# EAGLE design MKX-controller (EAGLE 6.3)
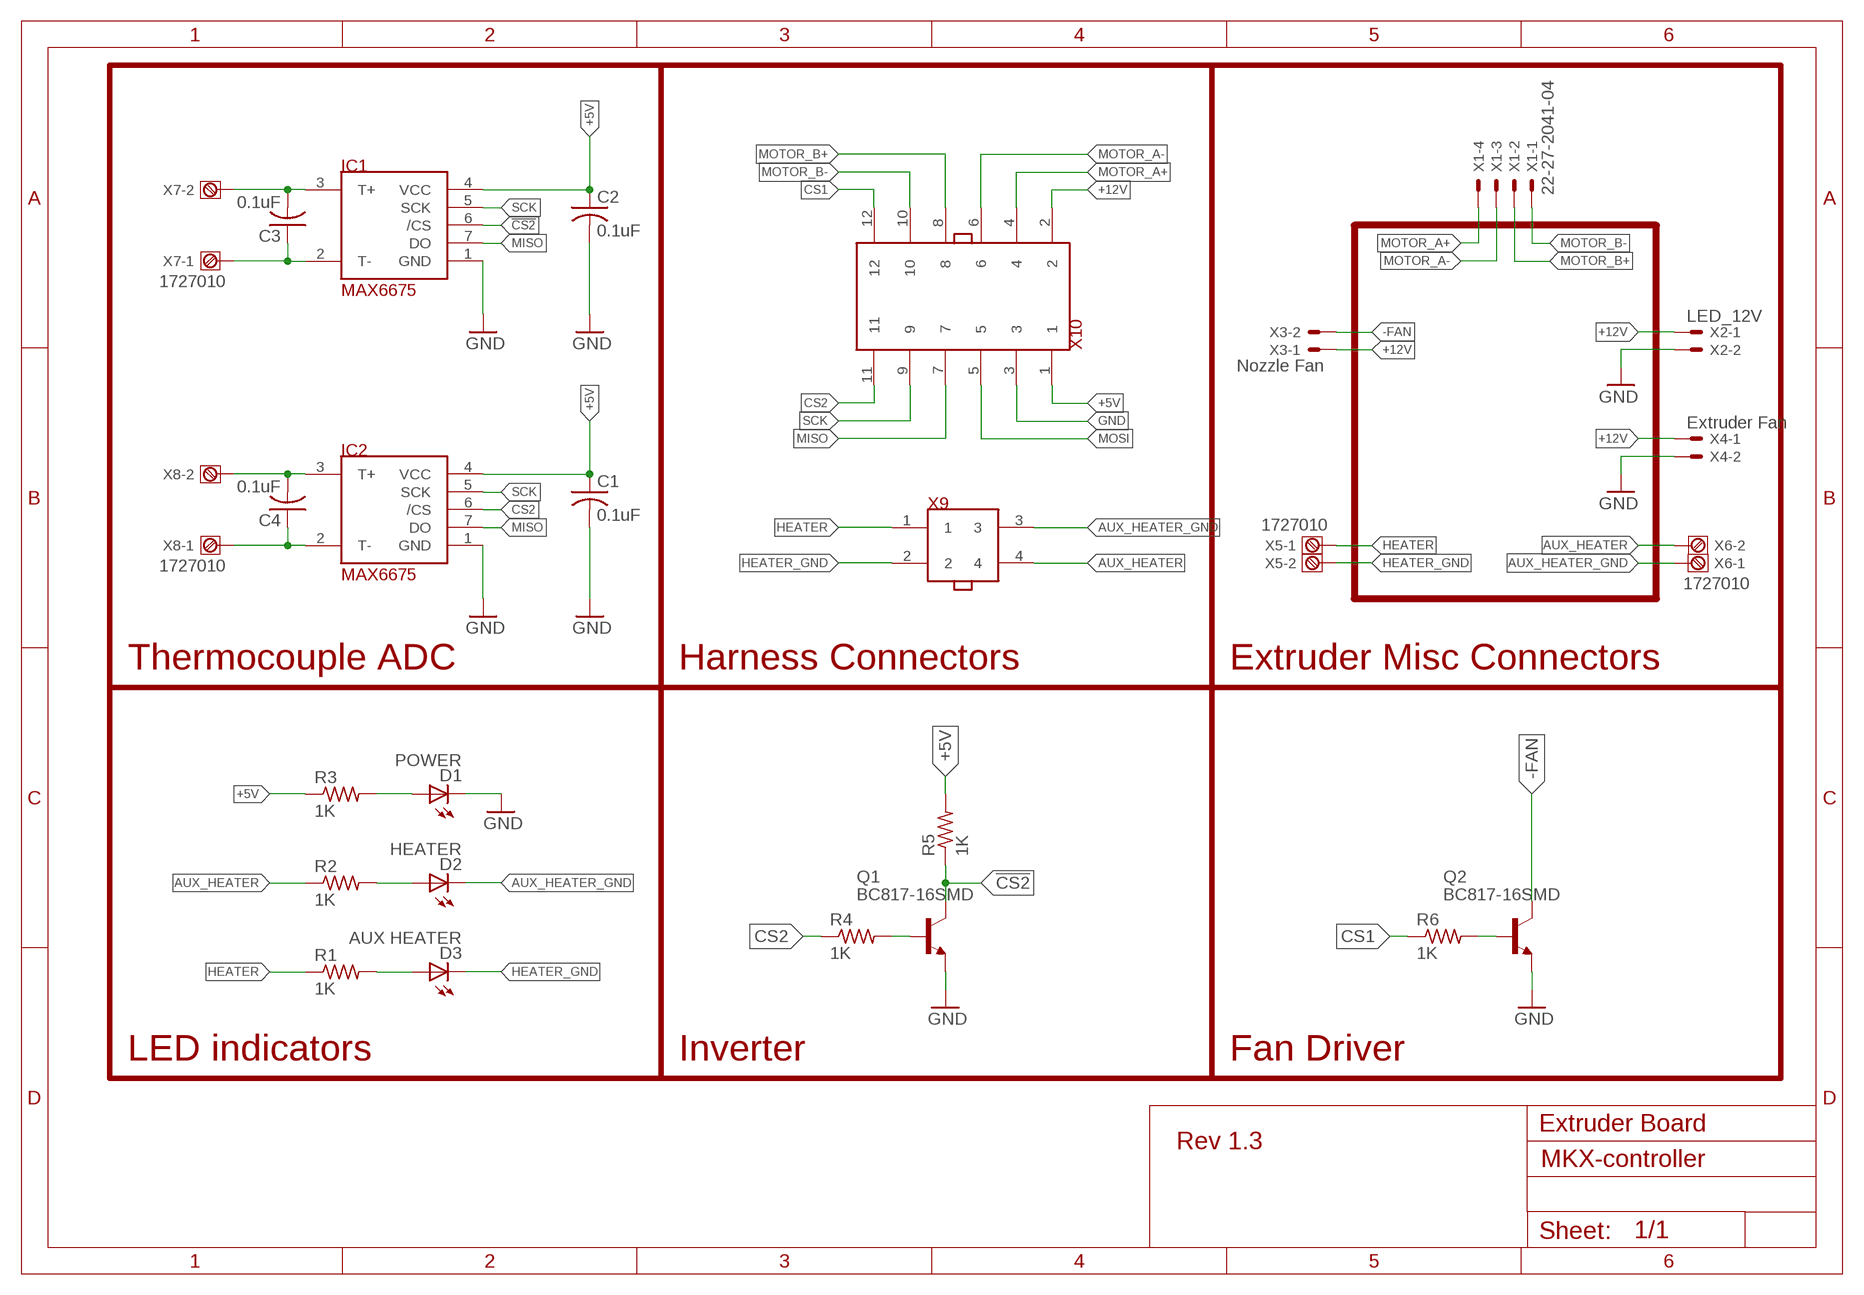
[diagram p0: schematic, sheet 1]

## Parts
C1  0.1uF  C-USC0603K  [C0603K]
C2  0.1uF  C-USC0603K  [C0603K]
C3  0.1uF  C-USC0603K  [C0603K]
C4  0.1uF  C-USC0603K  [C0603K]
D1  POWER  LEDCHIPLED_0805  [CHIPLED_0805]
D2  HEATER  LEDCHIPLED_0805  [CHIPLED_0805]
D3  AUX HEATER  LEDCHIPLED_0805  [CHIPLED_0805]
IC1  MAX6675  [SO-8]
IC2  MAX6675  [SO-8]
Q1  BC817-16SMD  [SOT23-BEC]
Q2  BC817-16SMD  [SOT23-BEC]
R1  1K  R-US_R0603  [R0603]
R2  1K  R-US_R0603  [R0603]
R3  1K  R-US_R0603  [R0603]
R4  1K  R-US_R0603  [R0603]
R5  1K  R-US_R0603  [R0603]
R6  1K  R-US_R0603  [R0603]
X1  22-27-2041-04  [6410-04]
X2  LED_12V  22-27-2021-02  [6410-02]
X3  Nozzle Fan  22-27-2021-02  [6410-02]
X4  Extruder Fan  22-27-2021-02  [6410-02]
X5  1727010  [1727010]
X6  1727010  [1727010]
X7  1727010  [1727010]
X8  1727010  [1727010]
X9  5557-04  [5557-04]
X10  5557-12  [5557-12]

## Nets
!CS2: IC1.6(/CS) Q1.C R5.1
+5V: C1.1 C2.1 IC1.4(VCC) IC2.4(VCC) R3.1 R5.2 X10.1
+12V: X2.1 X3.1 X4.1 X10.2
-FAN: Q2.C X3.2
AUX_HEATER: R2.1 X6.2 X9.4
AUX_HEATER_GND: D2.C X6.1 X9.3
CS1: R6.1 X10.12
CS2: IC2.6(/CS) R4.1 X10.11
GND: C1.2 C2.2 D1.C IC1.1(GND) IC2.1(GND) Q1.E Q2.E X2.2 X4.2 X10.3
HEATER: R1.1 X5.1 X9.1
HEATER_GND: D3.C X5.2 X9.2
MISO: IC1.7(DO) IC2.7(DO) X10.7
MOSI: X10.5
MOTOR_A+: X1.4 X10.4
MOTOR_A-: X1.3 X10.6
MOTOR_B+: X1.2 X10.8
MOTOR_B-: X1.1 X10.10
N$1: C4.1 IC2.2(T-) X8.1
N$2: C3.1 IC1.2(T-) X7.1
N$3: C3.2 IC1.3(T+) X7.2
N$4: C4.2 IC2.3(T+) X8.2
N$5: D1.A R3.2
N$6: Q1.B R4.2
N$7: D2.A R2.2
N$8: D3.A R1.2
N$9: Q2.B R6.2
SCK: IC1.5(SCK) IC2.5(SCK) X10.9

## Notes on the sheet
- Thermocouple ADC | Harness Connectors | Extruder Misc Connectors
- LED indicators | Inverter | Fan Driver
- Extruder Board
- Rev 1.3

## Library data of the parts
C1-C4 = extruder_board_--_placement_2:C-US: CAPACITOR, American symbol
D1-D3 = extruder_board_--_placement_2:LED: LED OSRAM: - CHIPLED LG R971, LG N971, LY N971, LG Q971, LY Q971, LO R971, LY R971 LH N974, LH R974 LS Q976, LO Q976, LY Q976 LO Q996 - Hyper CHIPLED LW Q18S LB Q993, LB Q99A, LB R99A - SideLED LS A670, LO A670, LY A670, LG A670, LP A670 LB A673, LV A673, LT A673, LW A673 LH A674 LY A675 LS A676, LA A676, LO A676, LY A676, LW A676 LS A679, LY A679, LG A679 - Hyper Micro SIDELED® LS Y876, LA Y876, LO Y876, LY Y876 LT Y87S - SmartLED LW L88C, LW L88S LB L89C, LB L89S, LG L890 LS L89K, LO L89K, LY L89K LS L896, LA L896, LO L896, LY L896 - TOPLED LS T670, LO T670, LY T670, LG T670, LP T670 LSG T670, LSP T670, LSY T670, LOP T670, LYG T670 LG T671, LOG T671, LSG T671 LB T673, LV T673, LT T673, LW T673 LH T674 LS T676, LA T676, LO T676, LY T676, LB T676, LH T676, LSB T676, LW T676 LB T67C, LV T67C, LT T67C, LS T67K, LO T67K, LY T67K, LW E67C LS E67B, LA E67B, LO E67B, LY E67B, LB E67C, LV E67C, LT E67C LW T67C LS T679, LY T679, LG T679 LS T770, LO T770, LY T770, LG T770, LP T770 LB T773, LV T773, LT T773, LW T773 LH T774 LS E675, LA E675, LY E675, LS T675 LS T776, LA T776, LO T776, LY T776, LB T776 LHGB T686 LT T68C, LB T68C - Hyper Mini TOPLED® LB M676 - Mini TOPLED Santana® LG M470 LS M47K, LO M47K, LY M47K Source: http://www.osram.convergy.de LUXEON: - LUMILED® LXK2-PW12-R00, LXK2-PW12-S00, LXK2-PW14-U00, LXK2-PW14-V00 LXK2-PM12-R00, LXK2-PM12-S00, LXK2-PM14-U00 LXK2-PE12-Q00, LXK2-PE12-R00, LXK2-PE12-S00, LXK2-PE14-T00, LXK2-PE14-U00 LXK2-PB12-K00, LXK2-PB12-L00, LXK2-PB12-M00, LXK2-PB14-N00, LXK2-PB14-P00, LXK2-PB14-Q00 LXK2-PR12-L00, LXK2-PR12-M00, LXK2-PR14-Q00, LXK2-PR14-R00 LXK2-PD12-Q00, LXK2-PD12-R00, LXK2-PD12-S00 LXK2-PH12-R00, LXK2-PH12-S00 LXK2-PL12-P00, LXK2-PL12-Q00, LXK2-PL12-R00 Source: www.luxeon.com KINGBRIGHT: KA-3528ASYC Source: www.kingbright.com
IC1 IC2 = extruder_board_--_placement_2:MAX6675
Q1 Q2 = extruder_board_--_placement_2:BC817*: NPN Transistor
R1-R6 = extruder_board_--_placement_2:R-US_: RESISTOR, American symbol
X1 = extruder_board_--_placement_2:22-?-04: CONNECTOR wire to board 2.54 mm (.1 inch) pitch header; OC_FARNELL: unknown; OC_NEWARK: unknown
X2-X4 = extruder_board_--_placement_2:22-?-02: CONNECTOR wire to board 2.54 mm (.1 inch) pitch header; OC_FARNELL: unknown; OC_NEWARK: unknown
X5-X8 = extruder_board_--_placement_2:1727010
X9 = extruder_board_--_placement_2:5557-04
X10 = extruder_board_--_placement_2:5557-12

## Net classes
1 power: width 1.27 mm

## Board
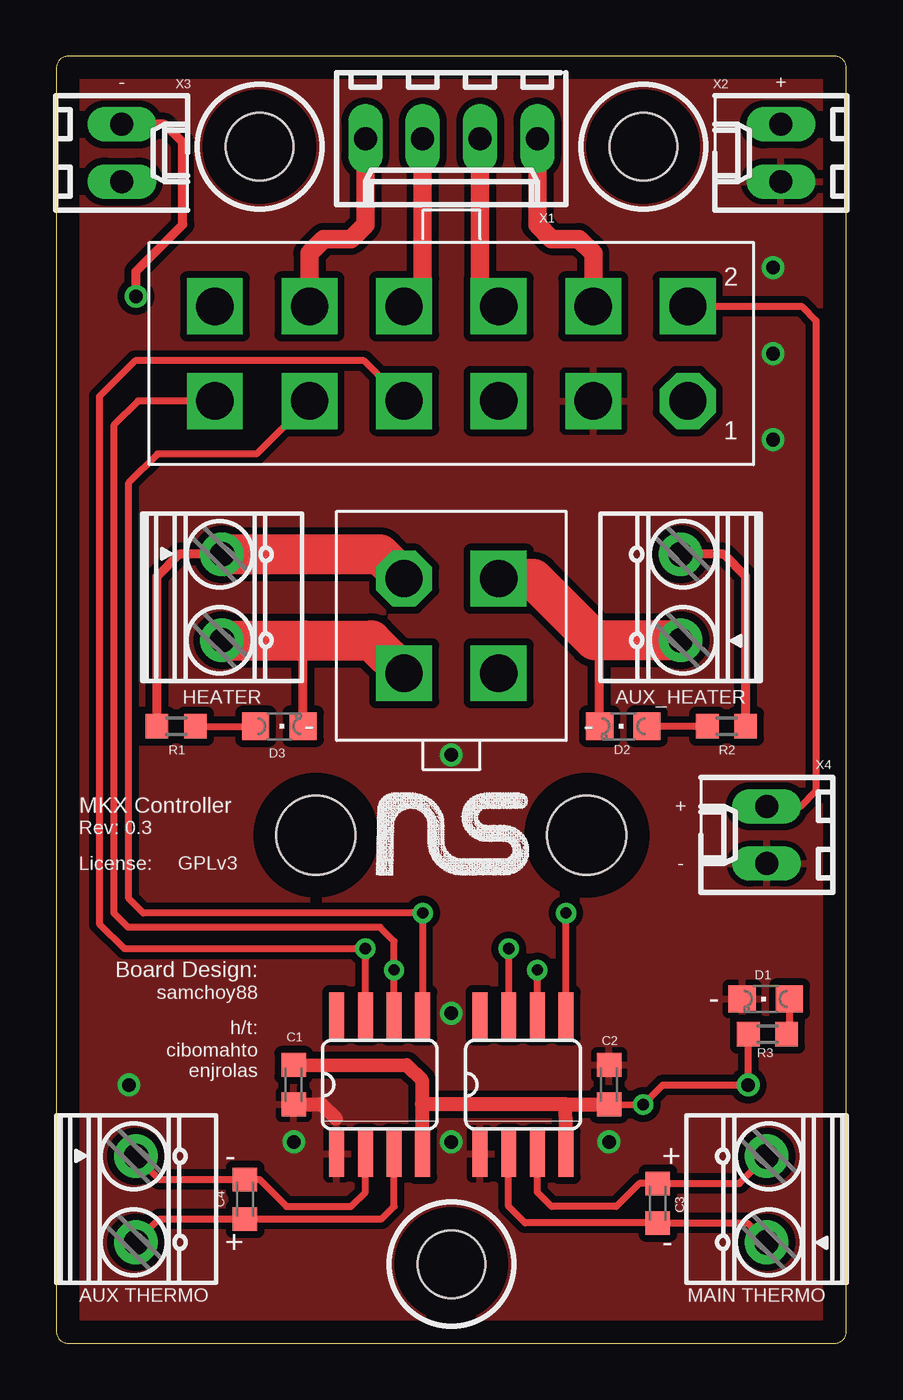
[diagram p1: board, top side]
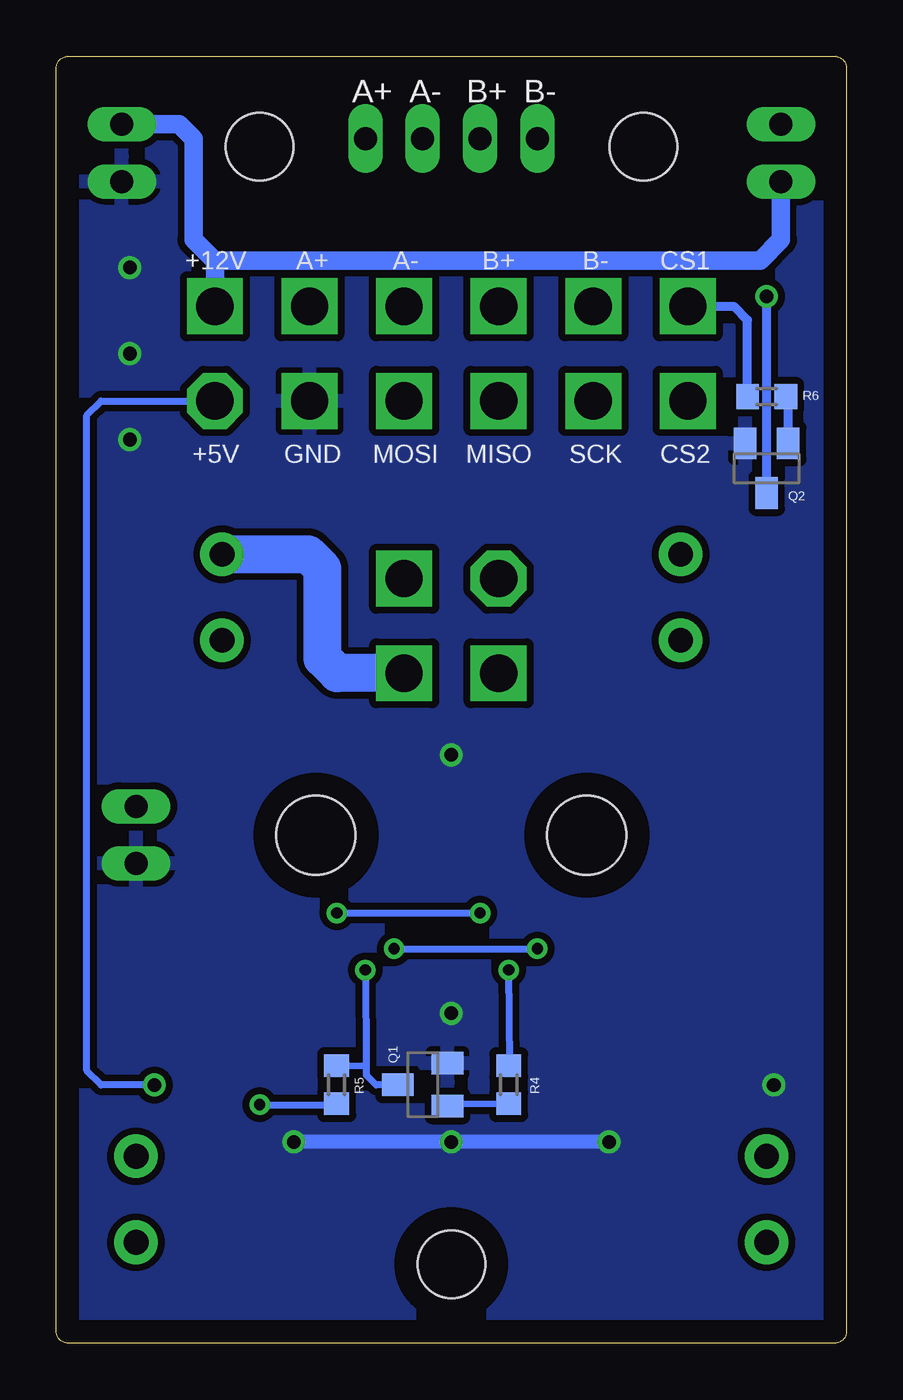
[diagram p2: board, bottom side, seen from below]

Size 35 x 57 mm. Coordinates in mm from the lower left corner, seen from the top.
Outline: 0,56.5 0,0.5 arc90 0.5,0 34.5,0 arc90 35,0.5 35,56.5 arc90 34.5,57 0.5,57 arc90 0,56.5
Copper layers (1*16): Top 0.035mm / dielectric 1.5mm / Bottom 0.035mm
Design rules "default": minimum track width 10mil, minimum drill 24mil, track to track 8mil, track to pad 8mil, pad to pad 8mil, via to via 8mil, smd to smd 8mil, copper to edge 40mil, drill to drill 8mil, minimum pad ring 10mil, minimum via ring 8mil, stop-mask expansion 4mil, vias tented up to drill 0mil, thermal gap 10mil
Holes 3 mm at 9,53 26,53 17.5,3.5
Holes 3.5 mm at 11.5,22.5 23.5,22.5

### Footprints (pad centres in the part's own frame; a part is rotated, then mirrored left to right if it is on the bottom)
C0603K = smd 1.05 x 1.08: 1 -0.875,0; 2 0.875,0
CHIPLED_0805 = smd 1.2 x 1.2: A 0,-1.05; C 0,1.05
SO-8 = smd 0.66 x 2.032: 1 -1.905,-3.073; 2 -0.635,-3.073; 3 0.635,-3.073; 4 1.905,-3.073; 5 1.905,3.073; 6 0.635,3.073; 7 -0.635,3.073; 8 -1.905,3.073
SOT23-BEC = smd 1 x 1.4: B -0.95,-1.1; C 0,1.1; E 0.95,-1.1
R0603 = smd 1 x 1.1: 1 -0.85,0; 2 0.85,0
6410-04 = drill 1.016 long: 1 3.81,0; 2 1.27,0; 3 -1.27,0; 4 -3.81,0
6410-02 = drill 1.016 long: 1 1.27,0; 2 -1.27,0
1727010 = drill 1.1 pad 1.93: 1 -1.905,0; 2 1.905,0
5557-04 = drill 1.651 octagon: 1 -2.095,2.095 | drill 1.651 square: 2 -2.095,-2.095; 3 2.095,2.095; 4 2.095,-2.095
5557-12 = drill 1.651 octagon: 1 -10.477,2.095 | drill 1.651 square: 2 -10.477,-2.095; 3 -6.287,2.095; 4 -6.287,-2.095; 5 -2.095,2.095; 6 -2.095,-2.095; 7 2.095,2.095; 8 2.095,-2.095; 9 6.287,2.095; 10 6.287,-2.095; 11 10.477,2.095; 12 10.477,-2.095

### Placement (x,y rotation side)
C1  10.52,11.45 270 top
C2  24.48,11.45 90 top
C3  26.64,6.2 90 top
C4  8.36,6.37 270 top
D1  31.43,15.24 90 top
D2  25.12,27.32 90 top
D3  9.88,27.32 270 top
IC1  20.68,11.45 0 top
IC2  14.32,11.45 0 top
Q1  18.77,11.45 90 bottom
Q2  3.53,38.76 180 bottom
R1  5.31,27.32 0 top
R2  29.69,27.32 180 top
R3  31.51,13.69 0 top
R4  14.96,11.45 270 bottom
R5  22.58,11.45 270 bottom
R6  3.53,41.93 0 bottom
X1  17.5,53.36 180 top
X2  32.11,52.73 90 top
X3  2.89,52.73 270 top
X4  31.47,22.51 90 top
X5  7.34,33.04 270 top
X6  27.66,33.04 90 top
X7  31.47,6.37 90 top
X8  3.53,6.37 270 top
X9  17.5,31.77 0 top
X10  17.5,43.84 180 top

### Tracks (layer width: path | path; a pad name or v marks a point on that pad's centre or on a via)
!CS2  (via drill 0.5)
  Top 0.305: IC1.6 v21.31,16.53
  Bottom 0.305: R5.1 21.27,12.29 | v21.31,16.53 21.27,12.29 | 21.27,12.29 21.27,11.87 20.83,11.43 Q1.C
+5V  (via drill 0.5, 0.6)
  Top 0.305: C2.1 v25.99,10.56 | v25.99,10.56 26.01,10.56 | R3.1 v30.66,11.43 26.87,11.43 v25.99,10.56
  Top 0.61: 22.54,10.59 IC1.4 | 16.19,10.59 16.19,11.65 15.53,12.31 C1.1 | 16.19,10.59 IC2.4 | 22.54,10.59 16.19,10.59 | 22.54,10.59 24.45,10.59 C2.1
  Bottom 0.305: v30.66,11.43 33.02,11.43 33.66,12.07 33.66,41.1 33.02,41.74 X10.1 | v25.99,10.56 22.61,10.56 R5.2
+12V
  Top 0.305: X10.2 33.02,45.93 33.66,45.3 33.66,24.45 32.98,23.78 X4.1
  Bottom 0.813: X10.2 27.98,47.92 | 27.98,47.92 27.94,47.96 3.81,47.96 2.89,48.88 X3.1 | 27.98,47.92 28.93,48.88 28.93,53.36 29.56,54 X2.1
-FAN  (via drill 0.6)
  Top 0.406: v3.53,46.38 3.53,47.49 5.59,49.55 5.59,53.2 4.8,54 X3.2
  Bottom 0.406: Q2.C v3.53,46.38
AUX_HEATER
  Top 0.406: R2.1 30.54,33.97 29.56,34.95 X6.2
  Bottom 1.676: X9.4 22.55,29.67 23.21,30.34 23.21,34.31 23.85,34.95 X6.2
AUX_HEATER_GND
  Top 0.406: D2.C 24.07,30.91 23.85,31.14
  Top 1.778: X6.1 23.85,31.14 21.12,33.87 X9.3
CS1
  Bottom 0.406: R6.1 4.38,45.32 4.99,45.93 X10.12
CS2  (via drill 0.5)
  Top 0.305: IC2.6 v14.96,16.53 14.96,17.8 14.34,18.42 3.18,18.42 2.54,19.05 2.54,40.66 3.62,41.74 X10.11
  Bottom 0.305: v14.96,16.53 14.92,12.32 R4.1
GND  (via drill 0.6)
  Top 0.61: C1.2 11.75,10.59 12.38,9.95
  Bottom 0.61: v10.52,8.91 v17.5,8.91 v24.48,8.91
  other vias: 17.5,26.05 31.75,47.64 3.21,11.43 17.5,14.61 31.75,43.84 31.75,40.02
  pour Top (isolate 0.305): -1.27,57.8 36.83,57.8 36.83,-0.8 -1.27,-0.8
  pour Bottom (isolate 0.305): -1.27,57.8 36.83,57.8 36.83,-0.8 -1.27,-0.8
HEATER
  Top 0.406: R1.1 4.46,33.97 5.44,34.95 X5.1
  Top 1.778: X5.1 14.32,34.95 X9.1
HEATER_GND
  Top 0.406: D3.C 10.93,31.07 10.99,31.14
  Top 1.778: X5.2 10.99,31.14 13.94,31.14 X9.2
MISO  (via drill 0.5)
  Top 0.305: IC2.7 v13.69,17.47 3.02,17.47 1.9,18.58 1.9,41.93 3.49,43.52 13.63,43.52 X10.7 | v20.04,17.47 IC1.7
  Bottom 0.305: v20.04,17.47 v13.69,17.47
MOTOR_A+
  Top 0.813: X1.4 21.31,49.55 21.95,48.91 23.15,48.91 23.79,48.28 X10.4
MOTOR_A-
  Top 0.813: X1.3 18.77,46.76 X10.6
MOTOR_B+
  Top 0.813: X1.2 16.23,46.76 X10.8
MOTOR_B-
  Top 0.813: X1.1 13.69,49.55 13.05,48.91 11.85,48.91 11.21,48.28 X10.10
N$1
  Top 0.305: X8.1 4.56,7.25 C4.1 9.01,7.25 10.2,6.05 13.05,6.05 13.69,6.69 IC2.2
N$2
  Top 0.305: X7.1 30.61,5.32 C3.1 20.77,5.32 20.04,6.05 IC1.2
N$3
  Top 0.305: X7.2 30.27,7.07 C3.2 25.82,7.07 24.8,6.05 21.95,6.05 21.31,6.69 IC1.3
N$4
  Top 0.305: X8.2 4.56,5.5 C4.2 14.4,5.5 14.96,6.05 IC2.3
N$5
  Top 0.305: D1.A 32.48,13.99 arc-45 R3.2
N$6
  Bottom 0.305: R4.2 17.57,10.59 Q1.B
N$7
  Top 0.305: R2.2 D2.A
N$8
  Top 0.305: R1.2 D3.A
N$9
  Bottom 0.406: Q2.B 2.58,41.83 R6.2
SCK  (via drill 0.5)
  Top 0.305: IC1.5 v22.58,19.05 | IC2.5 v16.23,19.05 3.85,19.05 3.21,19.69 3.21,38.12 4.48,39.39 8.86,39.39 X10.9
  Bottom 0.305: v22.58,19.05 v16.23,19.05

### Text on the board
tPlace: - | + | HEATER | AUX_HEATER | - | - | MKX Controller | + | Rev: 0.3 | GPLv3 | - | License: | Board Design: | samchoy88 | - | h/t: | cibomahto / enjrolas | - | + | + | - | AUX THERMO | MAIN THERMO
bPlace: B- | B+ | A- | A+ | CS1 | B- | B+ | A- | A+ | +12V | CS2 | SCK | MISO | MOSI | GND | +5V